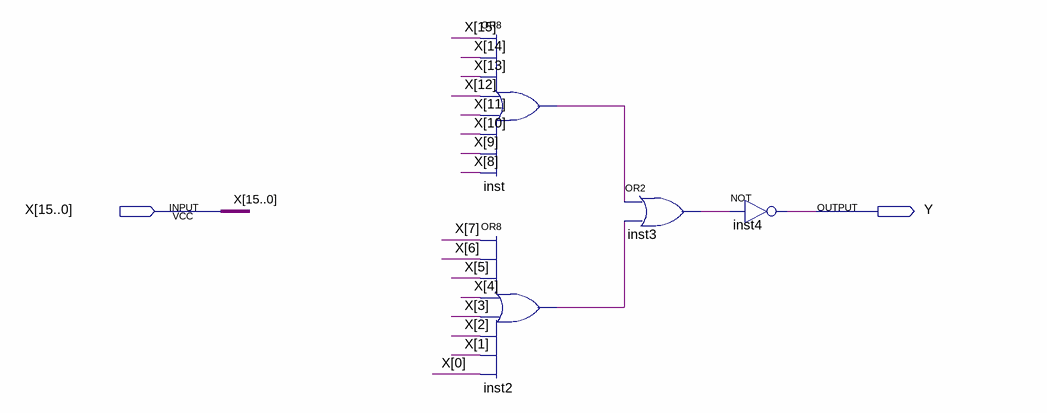
[diagram p0: schematic sheet]
// Quartus schematic NOT16.bdf as structural Verilog: 4 symbols, 2 pins
module NOT16 (
  input  [15:0] X,
  output Y
);

  wire inst2_out, inst3_out, inst_out;

  or inst (inst_out, X[15], X[14], X[13], X[12], X[11], X[10], X[9], X[8]);
  or inst2 (inst2_out, X[7], X[6], X[5], X[4], X[3], X[2], X[1], X[0]);
  or inst3 (inst3_out, inst_out, inst2_out);
  not inst4 (Y, inst3_out);
endmodule
